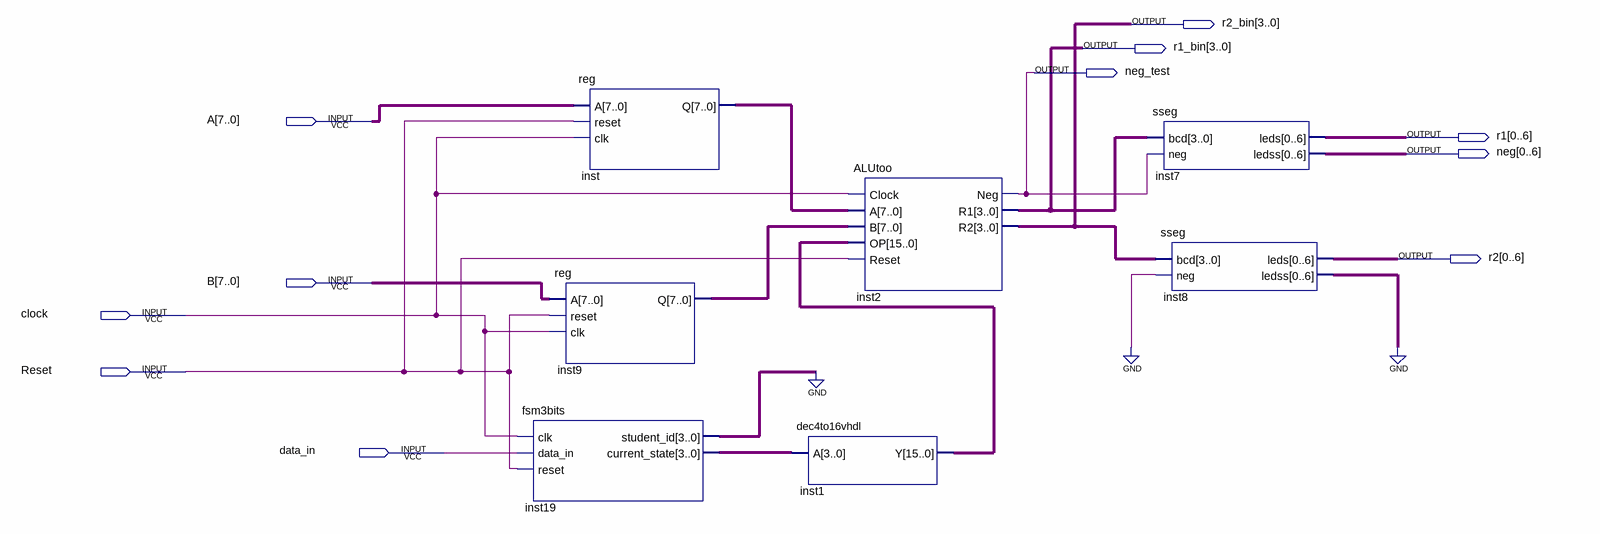
[diagram p0: schematic sheet]
// Quartus schematic Combined.bdf as structural Verilog: 7 symbols, 11 pins
module Combined (
  input  [7:0] A,
  input  [7:0] B,
  input  clock,
  input  Reset,
  input  data_in,
  output [3:0] r2_bin,
  output [3:0] r1_bin,
  output neg_test,
  output [0:6] r1,
  output [0:6] neg,
  output [0:6] r2
);

  wire [3:0] inst19_current_state, inst19_student_id;
  wire [6:0] inst8_ledss;
  wire [7:0] inst9_q, inst_q;
  wire [15:0] inst1_y;

  \reg  inst9 (.A(B), .reset(Reset), .clk(clock), .Q(inst9_q));
  fsm3bits inst19 (
    .clk(clock), .data_in(data_in), .reset(Reset), .student_id(inst19_student_id),
    .current_state(inst19_current_state));
  \reg  inst (.A(A), .reset(Reset), .clk(clock), .Q(inst_q));
  dec4to16vhdl inst1 (.A(inst19_current_state), .Y(inst1_y));
  ALUtoo inst2 (
    .Clock(clock), .A(inst_q), .B(inst9_q), .OP(inst1_y), .Reset(Reset), .Neg(neg_test), .R1(r1_bin),
    .R2(r2_bin));
  sseg inst7 (.bcd(r1_bin), .neg(neg_test), .leds(r1), .ledss(neg));
  sseg inst8 (.bcd(r2_bin), .neg(1'b0), .leds(r2), .ledss(inst8_ledss));
  // also tied to GND on the sheet: {inst19_student_id[0], inst19_student_id[1], inst19_student_id[2], inst19_student_id[3], inst8_ledss[0], inst8_ledss[1], inst8_ledss[2], inst8_ledss[3], inst8_ledss[4], inst8_ledss[5], inst8_ledss[6]}
endmodule
